# EAGLE schematic fmradio (EAGLE 9.6.2)

## Sheet 1 of 3: CPU
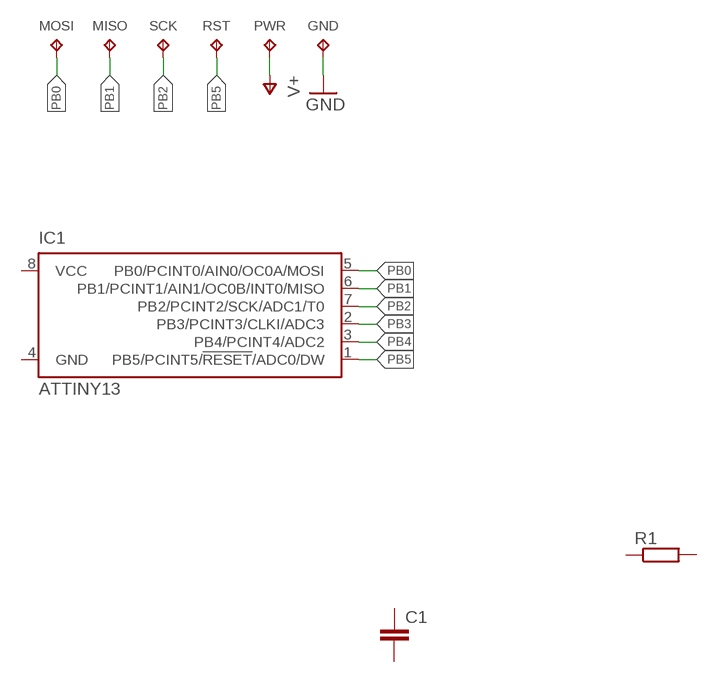
[diagram p0: schematic, sheet 1]

### Parts
C1  C0603NOMINAL  [C0603_NOMINAL]
GND  TPTP10R  [TP10R]
IC1  ATTINY13  [8S1]
MISO  TPTP10R  [TP10R]
MOSI  TPTP10R  [TP10R]
PWR  TPTP10R  [TP10R]
R1  R0603NOMINAL  [R0603_NOMINAL]
RST  TPTP15R  [TP15R]
SCK  TPTP10R  [TP10R]

### Nets
GND: GND.TP ; also sheet 2,3
PB0: IC1.5(PB0/PCINT0/AIN0/OC0A/MOSI) MOSI.TP
PB1: IC1.6(PB1/PCINT1/AIN1/OC0B/INT0/MISO) MISO.TP
PB2: IC1.7(PB2/PCINT2/SCK/ADC1/T0) SCK.TP
PB3: IC1.2(PB3/PCINT3/CLKI/ADC3)
PB4: IC1.3(PB4/PCINT4/ADC2)
PB5: IC1.1(PB5/PCINT5/!RESET!/ADC0/DW) RST.TP
V+: PWR.TP ; also sheet 3
Unconnected: C1.1 C1.2 IC1.4(GND) IC1.8(VCC) R1.1 R1.2

## Sheet 2 of 3: RADIO
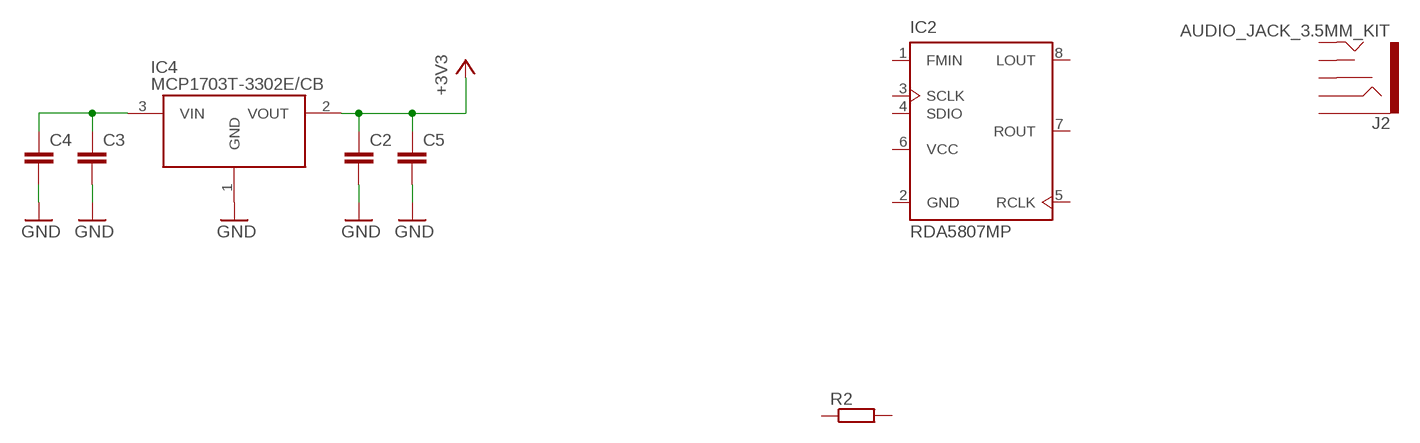
[diagram p1: schematic, sheet 2]

### Parts
C2  C0603NOMINAL  [C0603_NOMINAL]
C3  C0603NOMINAL  [C0603_NOMINAL]
C4  C0603NOMINAL  [C0603_NOMINAL]
C5  C0603NOMINAL  [C0603_NOMINAL]
IC2  RDA5807MP  [8S1]
IC4  MCP1703T-3302E/CB  [SOT95P255X145-3N]
J2  AUDIO_JACK_3.5MM_KIT  [AUDIO-JACK-KIT]
R2  R0603NOMINAL  [R0603_NOMINAL]

### Nets
+3V3: C2.1 C5.1 IC4.2(VOUT)
GND: C2.2 C3.2 C4.2 C5.2 IC4.1(GND) ; also sheet 1,3
N$2: C3.1 C4.1 IC4.3(VIN)
Unconnected: IC2.1(FMIN) IC2.2(GND) IC2.3(SCLK) IC2.4(SDIO) IC2.5(RCLK) IC2.6(VCC) IC2.7(ROUT) IC2.8(LOUT) J2.RING J2.RSH J2.SLEEVE J2.TIP J2.TSH R2.1 R2.2

## Sheet 3 of 3: CHARGER
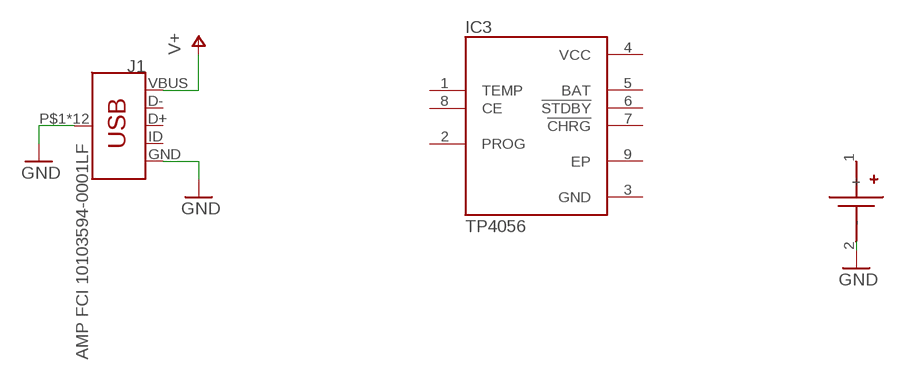
[diagram p2: schematic, sheet 3]

### Parts
IC3  TP4056  [SOP127P600X175-9N]
J1  AMP FCI 10103594-0001LF  USB_MICRO-B_HALF_PTH  [USB-MICROB-PTH]
U$1  BLOSSOM-BLM-18650-1PCS  [BLOSSOM-BLM-18650-1PCS]

### Nets
GND: J1.GND J1.P$1(SHIELD) J1.P$2(SHIELD) J1.P$3(SHIELD) J1.P$4(SHIELD) J1.P$6(SHIELD) J1.P$8(SHIELD) J1.P$10(SHIELD) J1.P$12(SHIELD) J1.SHEILD2(SHIELD) J1.SHIELD J1.SHIELD3(SHIELD) J1.SHIELD4(SHIELD) U$1.2(-) ; also sheet 1,2
V+: J1.VBUS ; also sheet 1
Unconnected: IC3.1(TEMP) IC3.2(PROG) IC3.3(GND) IC3.4(VCC) IC3.5(BAT) IC3.6(!STDBY) IC3.7(!CHRG) IC3.8(CE) IC3.9(EP) J1.D+ J1.D- J1.ID U$1.1(+)

## Library data of the parts
C1-C5 = C_SMD:C0603
GND MISO MOSI PWR RST SCK = testpad:TP: Test pad
IC1 = ATTINY13:ATTINY13
IC2 = RDA5807MP:RDA5807MP
IC3 = TP4056:TP4056: Complete single cell Li-Ion battery with a constant current / constant voltage linear charger Check availability <https://pricing.snapeda.com/parts/TP4056/NanJing%20Top%20Power%20ASIC%20Corp./view-part?ref=eda>; AVAILABILITY: Not in stock; DESCRIPTION: Complete single cell Li-Ion battery with a constant current / constant voltage linear charger; MF: NanJing Top Power ASIC Corp.; MP: TP4056; PACKAGE: Package; PRICE: None
IC4 = MCP1703T-3302E:MCP1703T-3302E/CB: Linear Voltage Regulator IC 1 Output 250mA SOT-23A-3 Check availability <https://pricing.snapeda.com/parts/MCP1703T-3302E/CB/Microchip/view-part?ref=eda>; AVAILABILITY: In Stock; DESCRIPTION: Linear Voltage Regulator IC Positive Fixed 1 Output 250mA SOT-23A-3; MF: Microchip; MP: MCP1703T-3302E/CB; PACKAGE: SOT23A Microchip; PRICE: None; PURCHASE-URL: https://pricing.snapeda.com/search/part/MCP1703T-3302E/CB/?ref=eda
J1 = SparkFun-Connectors:USB_MICRO-B: USB Type Micro-B Connector Male/female and PTH/SMT variants SparkFun Products: SparkFun microB USB Breakout <https://www.sparkfun.com/products/12035> SparkFun USB microB Plug Breakout <https://www.sparkfun.com/products/10031> SparkFun ESP8266 Thing <https://www.sparkfun.com/products/13231>; PROD_ID: CONN-13711
J2 = SparkFun-Connectors:AUDIO_JACK_3.5MM: Audio Jack 3.5mm variants of PTH and SMT stereo audio jack with bypass switches. SparkFun Products: SparkFun SparkPunk Sound Kit <[https://www.sparkfun.com/products/11177]> - PTH MP3 Trigger <https://www.sparkfun.com/products/13720> -3.5mm SMD SparkFun PicoBoard <https://www.sparkfun.com/products/11888>- 2.5mm SMD; PROD_ID: CONN-08774; SF_ID: PRT-08032
R1 R2 = R_SMD:R0603
U$1 = battery-holders:BLOSSOM-BLM-18650-1PCS